# EAGLE design LilyPad-E-Sewing-Kit (EAGLE 6.4)
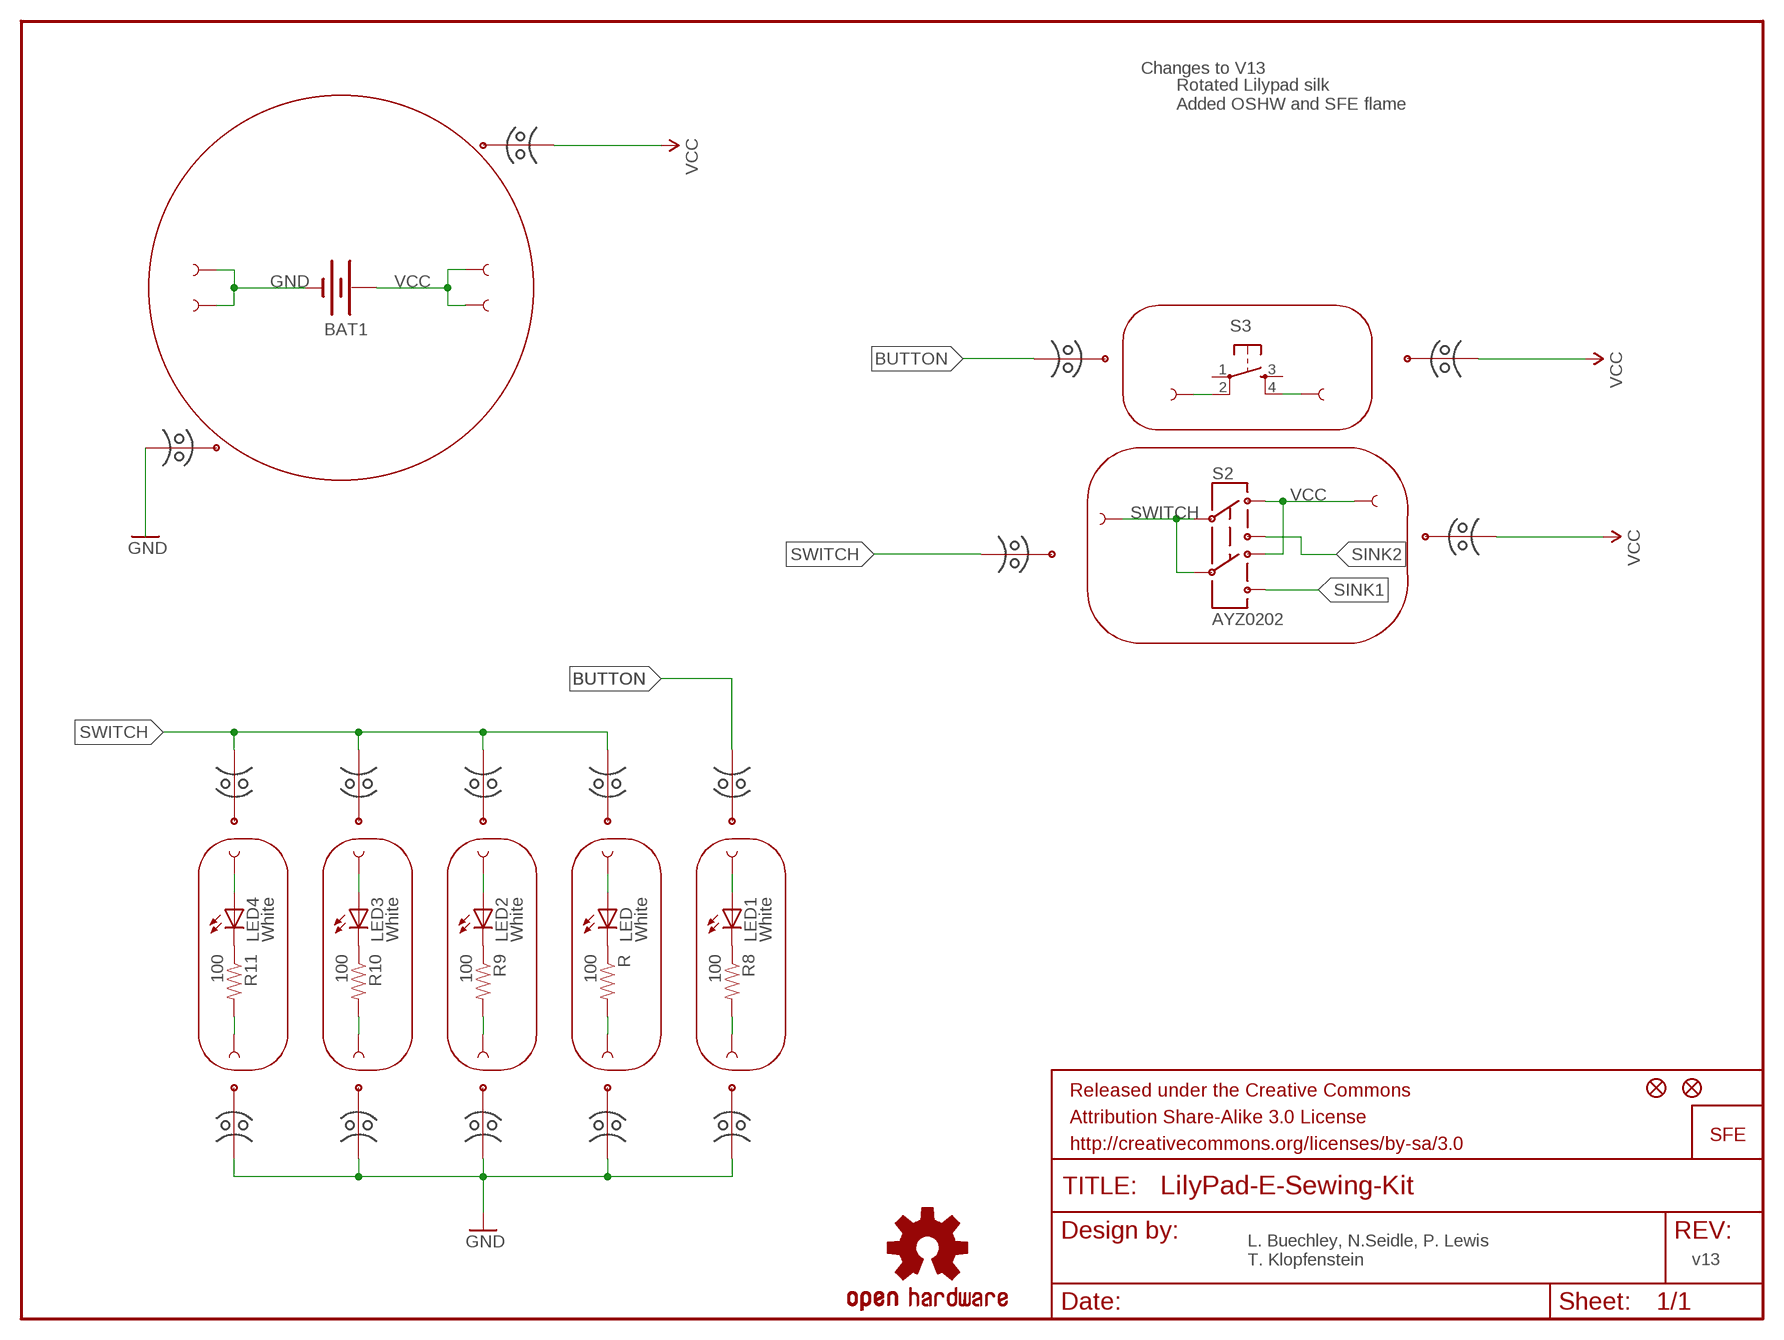
[diagram p0: schematic, sheet 1]

## Parts
BAT1  BATTERYBATTCON_20MM_4LEGS  [BATTCON_20MM_4LEGS]
BUTTON-  SEWTAP8  SEWTAP4  [PETAL-SMALL]
BUTTONS  SEWTAP8  SEWTAP4  [PETAL-SMALL]
JP1  FIDUCIAL1X2  [FIDUCIAL-1X2]
JP2  LOGO-SFESK  [SFE-LOGO-FLAME]
JP4  FIDUCIAL1X2  [FIDUCIAL-1X2]
LED  White  LED1206  [LED-1206]
LED1  White  LED1206  [LED-1206]
LED2  White  LED1206  [LED-1206]
LED3  White  LED1206  [LED-1206]
LED4  White  LED1206  [LED-1206]
LED+  SEWTAP6  [PETAL-SMALL-2SIDE]
LED+1  SEWTAP6  [PETAL-SMALL-2SIDE]
LED+2  SEWTAP6  [PETAL-SMALL-2SIDE]
LED+3  SEWTAP6  [PETAL-SMALL-2SIDE]
LED+4  SEWTAP6  [PETAL-SMALL-2SIDE]
LED-  SEWTAP6  [PETAL-SMALL-2SIDE]
LED-1  SEWTAP6  [PETAL-SMALL-2SIDE]
LED-2  SEWTAP6  [PETAL-SMALL-2SIDE]
LED-3  SEWTAP6  [PETAL-SMALL-2SIDE]
LED-4  SEWTAP6  [PETAL-SMALL-2SIDE]
R  100  RESISTOR0603-RES  [0603-RES]
R8  100  RESISTOR0603-RES  [0603-RES]
R9  100  RESISTOR0603-RES  [0603-RES]
R10  100  RESISTOR0603-RES  [0603-RES]
R11  100  RESISTOR0603-RES  [0603-RES]
S2  AYZ0202  [AYZ0202]
S3  TAC_SWITCHSMD  [TACTILE_SWITCH_SMD]
SLIDEOFF  SEWTAP8  SEWTAP4  [PETAL-SMALL]
SLIDEON  SEWTAP8  SEWTAP4  [PETAL-SMALL]
U$1  SEWTAP6  [PETAL-SMALL-2SIDE]
U$2  SEWTAP6  [PETAL-SMALL-2SIDE]
U$3  SEWTAP6  [PETAL-SMALL-2SIDE]
U$4  SEWTAP6  [PETAL-SMALL-2SIDE]
U$6  MOUSE-BITE-12_HOLES  [MOUST-BITE-1-(2_HOLES)]
U$7  MOUSE-BITE-12_HOLES  [MOUST-BITE-1-(2_HOLES)]
U$8  OSHW-LOGOS  [OSHW-LOGO-S]
U$10  MOUSE-BITE-12_HOLES  [MOUST-BITE-1-(2_HOLES)]
U$11  MOUSE-BITE-12_HOLES  [MOUST-BITE-1-(2_HOLES)]
U$12  MOUSE-BITE-12_HOLES  [MOUST-BITE-1-(2_HOLES)]
U$13  MOUSE-BITE-12_HOLES  [MOUST-BITE-1-(2_HOLES)]
U$14  MOUSE-BITE-12_HOLES  [MOUST-BITE-1-(2_HOLES)]
U$15  MOUSE-BITE-12_HOLES  [MOUST-BITE-1-(2_HOLES)]
U$16  MOUSE-BITE-12_HOLES  [MOUST-BITE-1-(2_HOLES)]
U$17  MOUSE-BITE-12_HOLES  [MOUST-BITE-1-(2_HOLES)]
U$18  MOUSE-BITE-12_HOLES  [MOUST-BITE-1-(2_HOLES)]
U$19  MOUSE-BITE-12_HOLES  [MOUST-BITE-1-(2_HOLES)]
U$40  MOUSE-BITE-12_HOLES  [MOUST-BITE-1-(2_HOLES)]
U$42  MOUSE-BITE-12_HOLES  [MOUST-BITE-1-(2_HOLES)]
U$44  MOUSE-BITE-12_HOLES  [MOUST-BITE-1-(2_HOLES)]
U$46  MOUSE-BITE-12_HOLES  [MOUST-BITE-1-(2_HOLES)]

## Nets
BUTTON: BUTTONS.1 LED1.A LED+1.1 S3.2 U$13.P$1 U$42.P$1
GND [VCC]: BAT1.2(-) LED-1.1 LED-2.1 LED-3.1 LED-4.1 LED-.1 R8.2 R9.2 R10.2 R11.2 R.2 U$1.1 U$3.1 U$7.P$1 U$15.P$1 U$16.P$1 U$17.P$1 U$18.P$1 U$19.P$1
N$18: LED.C R.1
N$21: LED1.C R8.1
N$24: LED2.C R9.1
N$27: LED3.C R10.1
N$30: LED4.C R11.1
SINK1: S2.4
SINK2: S2.1
SWITCH: LED2.A LED3.A LED4.A LED+2.1 LED+3.1 LED+4.1 LED+.1 LED.A S2.2 S2.5 SLIDEOFF.1 U$10.P$1 U$11.P$1 U$12.P$1 U$14.P$1 U$44.P$1
VCC: BAT1.1(+) BUTTON-.1 S2.3 S2.6 S3.4 SLIDEON.1 U$2.1 U$4.1 U$6.P$1 U$40.P$1 U$46.P$1
Unconnected: S3.1 S3.3

## Notes on the sheet
- Changes to V13
- Rotated Lilypad silk
  Added OSHW and SFE flame
- L. Buechley, N.Seidle, P. Lewis
  T. Klopfenstein
- v13

## Library data of the parts
BAT1 = Testing:BATTERY: Battery Holders Various common sizes : AA, AAA, 20mm coin cell and 12mm coin cell.
BUTTON- BUTTONS LED+ LED+1-LED+4 LED- LED-1-LED-4 SLIDEOFF SLIDEON U$1-U$4 = LilyPad-Wearables:SEWTAP
JP1 JP4 = SparkFun:FIDUCIAL: Fiducial Alignment Points Various fiducial points for machine vision alignment.
JP2 = SparkFun-Aesthetics:LOGO-SFE: Spark Fun Electronics PCB Logo This is the standard Spark Fun Electronics PCB logo.
LED LED1-LED4 = SparkFun-3-2-07:LED: LEDs Standard schematic elements and footprints for 5mm, 3mm, 1206, and 0603 sized LEDs. 5mm - Spark Fun Electronics SKU : Comp-SBL
R R8-R11 = SparkFun:RESISTOR: Resistor Basic schematic elements and footprints for 0603, 1206, and PTH resistors.
S2 = SparkFun:AYZ0202: SPDT Slide Switch Simple SMD single-pull double-throw slide switch. Good for less than 350mA power switch, switching UARTs between devices, etc. Spark Fun Electronics SKU : COM-00597
S3 = SparkFun:TAC_SWITCH: Momentary Switch Button commonly used for reset or general input. Spark Fun Electronics SKU : COM-00097
U$6 U$7 U$10-U$19 U$40 U$42 U$44 U$46 = Testing:MOUSE-BITE-1
U$8 = SparkFun-Aesthetics:OSHW-LOGO: Open Source Hardware Logo This logo indicates the piece of hardware it is found on incorporates a OSHW license and/or adheres to the definition of open source hardware found here: http://freedomdefined.org/OSHW

## Net classes
1 VCC: width 0.203 mm

## Board
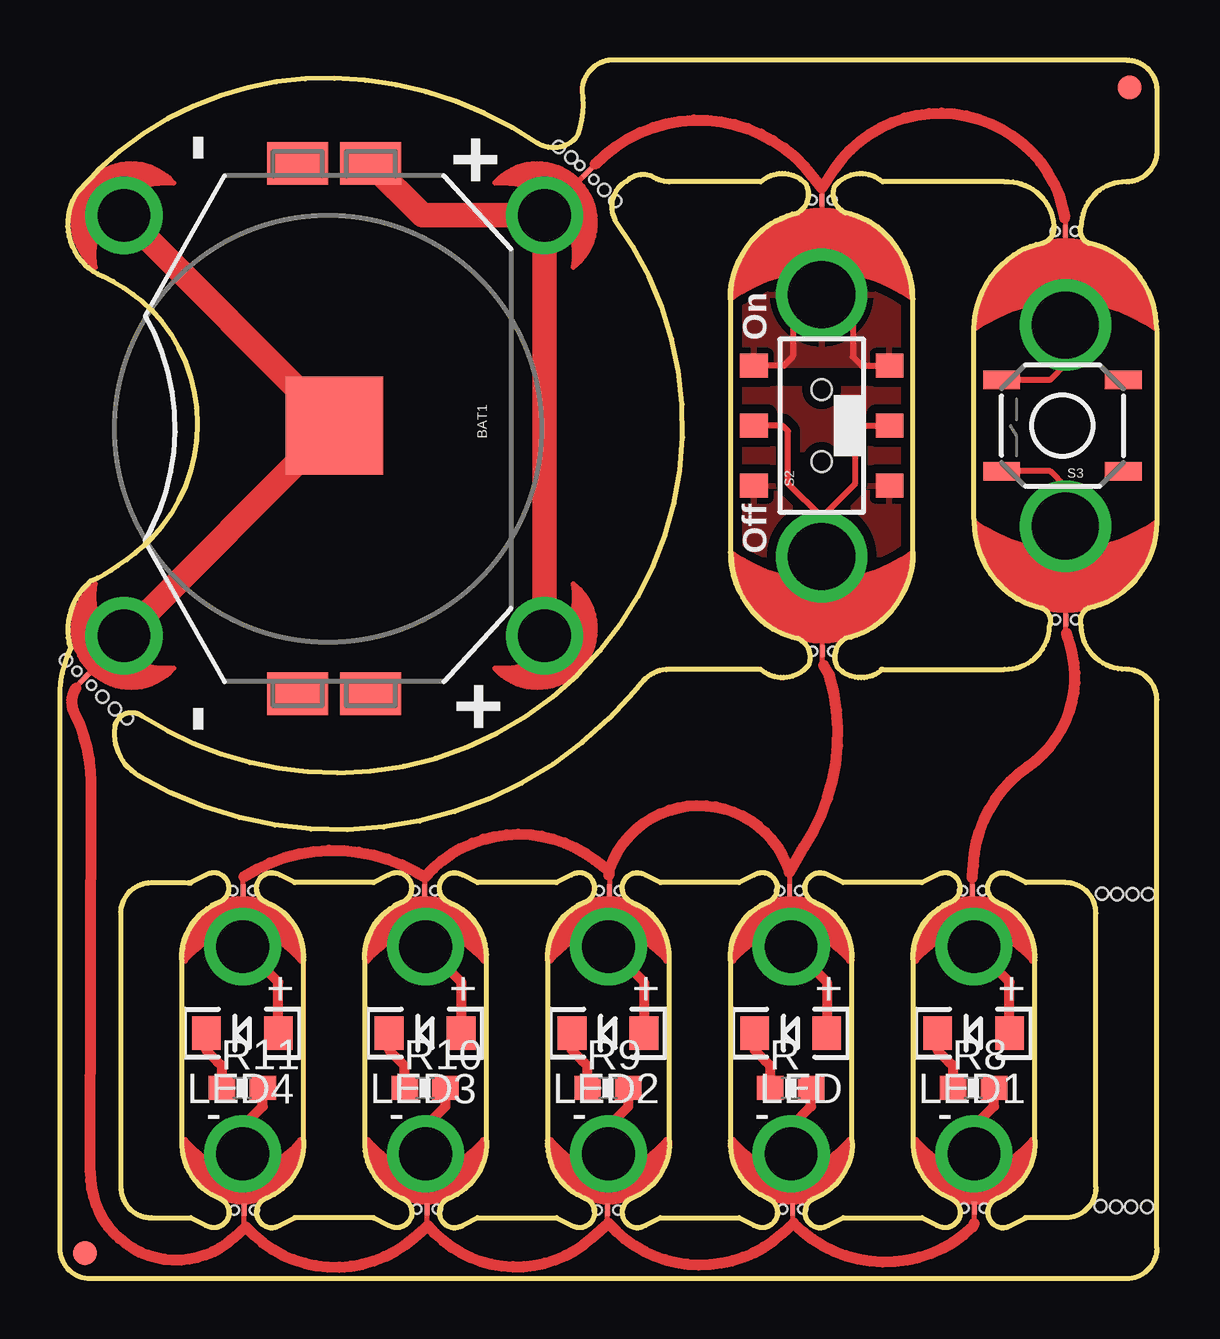
[diagram p1: board, top side]
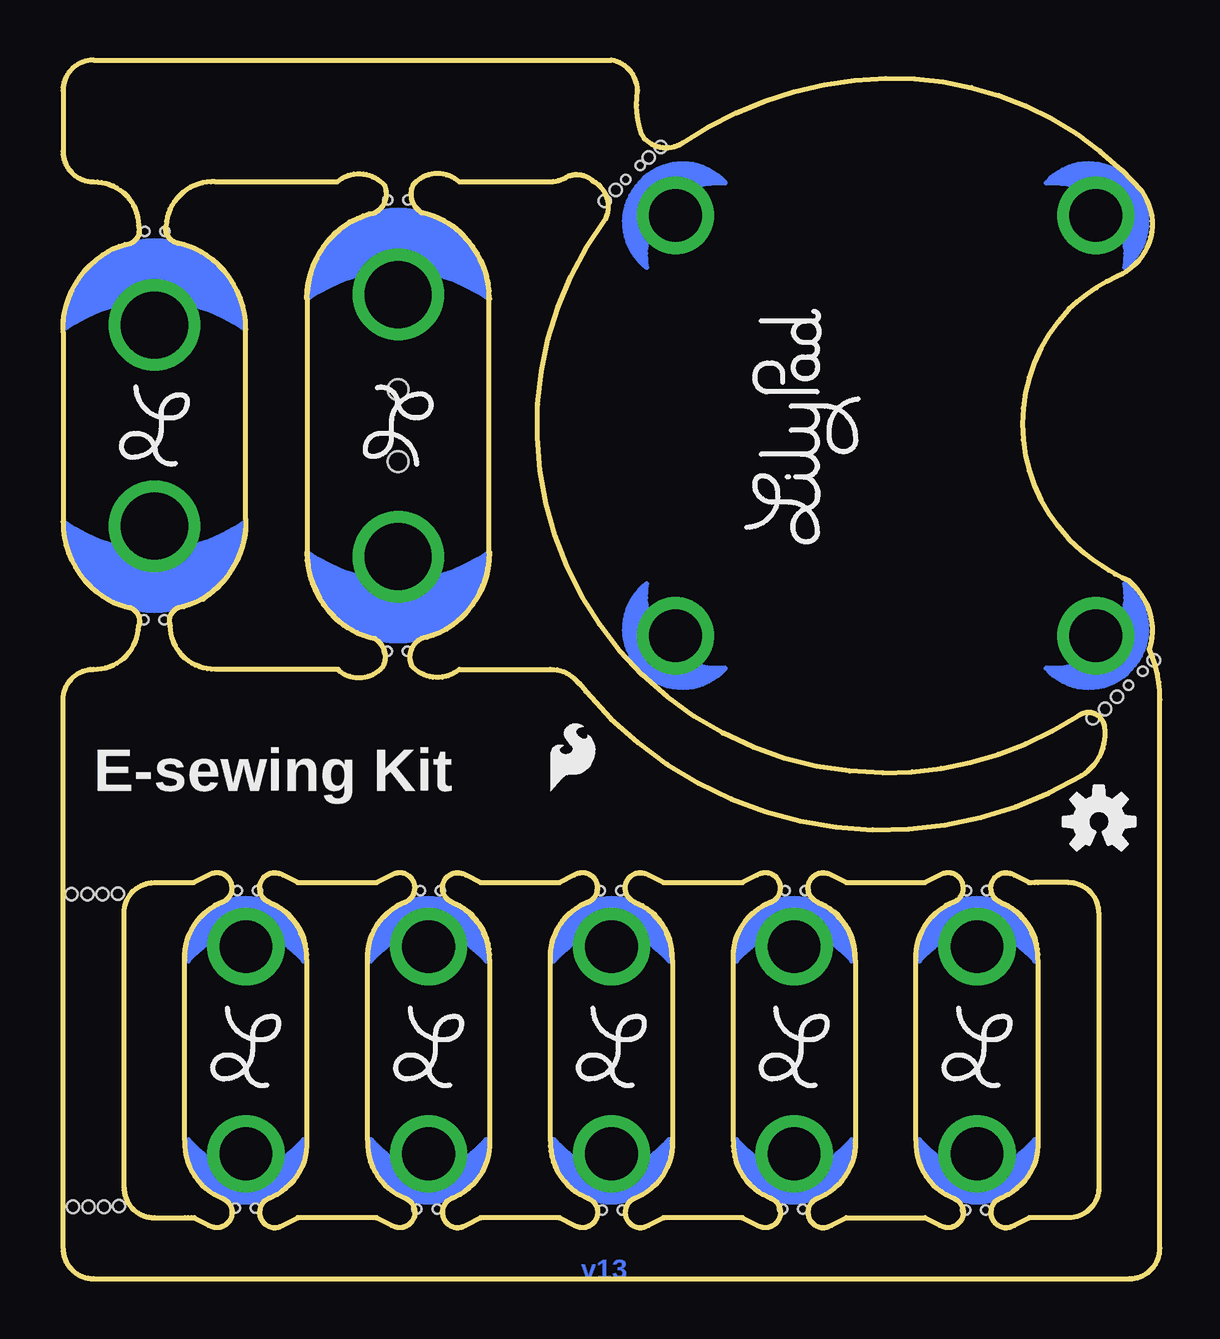
[diagram p2: board, bottom side, seen from below]

Size 45.72 x 50.8 mm. Coordinates in mm from the lower left corner, seen from the top.
Outline: 45.72,39.47 45.72,31.55
Outline: 45.72,31.55 arc-56 44.07,28.45
Outline: 38.1,31.62 arc57 39.88,28.32
Outline: 38.1,31.65 38.1,39.57
Outline: 38.1,39.57 arc-56 39.75,42.67
Outline: 29.72,27.08 arc-57 27.96,30.28 27.96,41.02
Outline: 27.96,41.02 arc-18 28.12,41.96
Outline: 28.12,41.96 arc-25 29.01,43.46
Outline: 29.01,43.46 arc-14 29.64,43.99
Outline: 33.78,44.04 arc-57 35.53,40.84 35.53,30.1
Outline: 35.53,30.1 arc-18 35.38,29.16
Outline: 35.38,29.16 arc-25 34.49,27.66
Outline: 34.49,27.66 arc-14 33.86,27.13 arc14 34.49,27.66
Outline: 40.24,2.54 arc1 40.64,2.54 41.91,2.54 arc90 43.18,3.81 43.18,15.24 arc90 41.91,16.51 40.26,16.51
Outline: 23.12,44.15 arc-126 11.56,21.08 arc-33 3.43,23.44 arc4 3.24,23.56
Outline: 19.94,47.31 arc33 11.43,50.04 arc50 0.76,45.34 arc103 1.78,41.78 arc-20 3.81,40.39 arc-88 3.81,30.86 arc-14 2.41,29.72 arc-13 1.27,29.08
Outline: 34.24,25.4 39.37,25.4 arc90 41.25,27.21
Outline: 21.48,47.52 arc-77 19.9,47.34
Outline: 23.13,44.13 arc-88 23.62,45.75 arc-64 24.66,45.96 arc32 25.4,45.72 29.21,45.72 arc-90 31.1,45.63
Outline: 0.45,26.26 arc26 0,24.13 0,1.27 arc90 1.27,0 44.45,0 arc90 45.72,1.27 45.72,24.13 arc90 44.45,25.4 arc-90 42.57,27.21
Outline: 24.22,24.81 arc-53 25.4,25.4 29.21,25.4 arc90 31.19,25.56
Outline: 24.22,24.83 23.92,24.47 arc-81 3.28,20.96 arc-67 2.3,23 arc-106 3.26,23.54
Outline: 21.49,47.51 21.61,47.72 arc27 21.77,49.52 arc-79 22.86,50.8 44.45,50.8 arc-90 45.72,49.53 45.72,46.99 arc-90 44.45,45.72 arc90 42.57,43.91
Outline: 1.27,29.08 1.09,28.9 arc63 0.45,26.25
Outline: 5.48,16.5 arc1 5.08,16.51 3.81,16.51 arc90 2.54,15.24 2.54,3.81 arc90 3.81,2.54 5.46,2.54
Outline: 8.76,15.62 arc-65 10.16,13.41 10.16,5.77
Outline: 5.08,13.28 arc-64 6.46,15.61
Outline: 10.16,5.77 arc-64 8.91,3.5 arc64 10.16,5.77
Outline: 5.08,13.28 5.08,5.64
Outline: 10.16,13.28 arc64 8.91,15.54
Outline: 9.17,16.82 9.04,16.88 arc90 8.23,16.5 arc90 8.61,15.69 8.93,15.54
Outline: 9.79,16.51 9.18,16.82
Outline: 5.08,13.28 arc-64 6.33,15.54
Outline: 6.07,16.82 6.2,16.88 arc-90 7.01,16.5 arc-90 6.63,15.69 6.31,15.54
Outline: 5.45,16.51 6.07,16.82
Outline: 5.08,5.77 arc64 6.33,3.5
Outline: 6.07,2.23 6.2,2.17 arc90 7.01,2.55 arc90 6.63,3.36 6.31,3.51
Outline: 5.45,2.54 6.07,2.23
Outline: 9.17,2.23 9.04,2.17 arc-90 8.23,2.55 arc-90 8.61,3.36 8.93,3.51
Outline: 9.79,2.54 9.18,2.23
Outline: 16.38,15.62 arc-65 17.78,13.41 17.78,5.77
Outline: 12.7,13.28 arc-64 14.08,15.61
Outline: 17.78,5.77 arc-64 16.54,3.5 arc64 17.78,5.77
Outline: 12.7,13.28 12.7,5.64
Outline: 17.78,13.28 arc64 16.54,15.54
Outline: 16.79,16.82 16.66,16.88 arc90 15.85,16.5 arc90 16.23,15.69 16.55,15.54
Outline: 17.41,16.51 16.79,16.82
Outline: 12.7,13.28 arc-64 13.95,15.54
Outline: 13.69,16.82 13.81,16.88 arc-90 14.63,16.5 arc-90 14.25,15.69 13.93,15.54
Outline: 13.07,16.51 13.69,16.82
Outline: 12.7,5.77 arc64 13.95,3.5
Outline: 13.69,2.23 13.81,2.17 arc90 14.63,2.55 arc90 14.25,3.36 13.93,3.51
Outline: 13.07,2.54 13.69,2.23
Outline: 16.79,2.23 16.66,2.17 arc-90 15.85,2.55 arc-90 16.23,3.36 16.55,3.51
Outline: 17.41,2.54 16.79,2.23
Outline: 24,15.62 arc-65 25.4,13.41 25.4,5.77
Outline: 20.32,13.28 arc-64 21.7,15.61
Outline: 25.4,5.77 arc-64 24.16,3.5 arc64 25.4,5.77
Outline: 20.32,13.28 20.32,5.64
Outline: 25.4,13.28 arc64 24.16,15.54
Outline: 24.41,16.82 24.29,16.88 arc90 23.47,16.5 arc90 23.85,15.69 24.17,15.54
Outline: 25.03,16.51 24.41,16.82
Outline: 20.32,13.28 arc-64 21.57,15.54
Outline: 21.31,16.82 21.43,16.88 arc-90 22.25,16.5 arc-90 21.87,15.69 21.55,15.54
Outline: 20.69,16.51 21.3,16.82
Outline: 20.32,5.77 arc64 21.57,3.5
Outline: 21.31,2.23 21.43,2.17 arc90 22.25,2.55 arc90 21.87,3.36 21.55,3.51
Outline: 20.69,2.54 21.3,2.23
Outline: 24.41,2.23 24.29,2.17 arc-90 23.47,2.55 arc-90 23.85,3.36 24.17,3.51
Outline: 25.03,2.54 24.41,2.23
Outline: 31.62,15.62 arc-65 33.02,13.41 33.02,5.77
Outline: 27.94,13.28 arc-64 29.32,15.61
Outline: 33.02,5.77 arc-64 31.77,3.5 arc64 33.02,5.77
Outline: 27.94,13.28 27.94,5.64
Outline: 33.02,13.28 arc64 31.77,15.54
Outline: 32.03,16.82 31.91,16.88 arc90 31.09,16.5 arc90 31.47,15.69 31.79,15.54
Outline: 32.65,16.51 32.03,16.82
Outline: 27.94,13.28 arc-64 29.18,15.54
Outline: 28.93,16.82 29.05,16.88 arc-90 29.87,16.5 arc-90 29.49,15.69 29.17,15.54
Outline: 28.31,16.51 28.93,16.82
Outline: 27.94,5.77 arc64 29.18,3.5
Outline: 28.93,2.23 29.05,2.17 arc90 29.87,2.55 arc90 29.49,3.36 29.17,3.51
Outline: 28.31,2.54 28.93,2.23
Outline: 32.03,2.23 31.91,2.17 arc-90 31.09,2.55 arc-90 31.47,3.36 31.79,3.51
Outline: 32.65,2.54 32.03,2.23
Outline: 39.24,15.62 arc-65 40.64,13.41 40.64,5.77
Outline: 35.56,13.28 arc-64 36.94,15.61
Outline: 40.64,5.77 arc-64 39.4,3.5 arc64 40.64,5.77
Outline: 35.56,13.28 35.56,5.64
Outline: 40.64,13.28 arc64 39.4,15.54
Outline: 39.65,16.82 39.52,16.88 arc90 38.71,16.5 arc90 39.09,15.69 39.41,15.54
Outline: 40.27,16.51 39.65,16.82
Outline: 35.56,13.28 arc-64 36.8,15.54
Outline: 36.55,16.82 36.67,16.88 arc-90 37.49,16.5 arc-90 37.11,15.69 36.79,15.54
Outline: 35.93,16.51 36.55,16.82
Outline: 35.56,5.77 arc64 36.8,3.5
Outline: 36.55,2.23 36.67,2.17 arc90 37.49,2.55 arc90 37.11,3.36 36.79,3.51
Outline: 35.93,2.54 36.55,2.23
Outline: 39.65,2.23 39.52,2.17 arc-90 38.71,2.55 arc-90 39.09,3.36 39.41,3.51
Outline: 40.27,2.54 39.65,2.23
Outline: 41.43,43.89 arc90 39.37,45.72 34.29,45.72 arc90 32.31,45.56
Outline: 38.1,39.57 arc-56 39.75,42.67
Outline: 45.72,31.55 arc-56 44.07,28.45
Outline: 40.91,43.16 arc90 41.43,43.89
Outline: 39.75,42.67 arc-23 40.94,43.16 arc23 39.75,42.67
Outline: 38.1,39.57 arc-56 39.75,42.67
Outline: 38.1,31.55 arc56 39.75,28.45 arc23 40.94,27.96
Outline: 40.91,27.96 arc-90 41.25,27.21
Outline: 45.72,31.55 arc-56 44.07,28.45
Outline: 42.91,27.96 arc90 42.57,27.21
Outline: 44.07,28.45 arc-23 42.88,27.96
Outline: 45.72,39.57 arc56 44.07,42.67 arc23 42.88,43.16
Outline: 42.91,43.16 arc-90 42.57,43.91
Outline: 27.96,41.02 arc-18 28.12,41.96
Outline: 28.12,41.96 arc-25 29.01,43.46
Outline: 35.53,30.1 arc-18 35.38,29.16
Outline: 35.38,29.16 arc-25 34.49,27.66
Outline: 27.94,30.28 arc56 29.59,27.18 arc23 30.78,26.69
Outline: 30.75,26.69 arc-90 31.19,25.55
Outline: 34.29,25.4 arc-90 32.4,25.49
Outline: 35.56,30.28 arc-56 33.91,27.18 arc-23 32.72,26.69
Outline: 32.75,26.69 arc90 32.4,25.48
Outline: 35.56,40.84 arc56 33.91,43.94 arc23 32.72,44.43
Outline: 32.75,44.43 arc-90 32.31,45.57
Outline: 27.94,40.84 arc-56 29.59,43.94 arc-23 30.78,44.43
Outline: 30.75,44.43 arc90 31.1,45.64
Outline: 13.08,2.54 9.78,2.54
Outline: 17.4,2.54 20.7,2.54
Outline: 25.02,2.54 28.32,2.54
Outline: 32.64,2.54 35.94,2.54
Outline: 35.94,16.51 32.64,16.51
Outline: 28.32,16.51 25.02,16.51
Outline: 20.7,16.51 17.4,16.51
Outline: 13.08,16.51 9.78,16.51
Copper layers (1*16): Top 0.035mm / dielectric 1.5mm / Bottom 0.035mm
Design rules "SparkFun *": minimum track width 6mil, minimum drill 15mil, track to track 8mil, track to pad 8mil, pad to pad 8mil, via to via 8mil, smd to smd 8mil, copper to edge 10mil, drill to drill 8mil, minimum pad ring 12mil, minimum via ring 10mil, stop-mask expansion 4mil, vias tented up to drill 20mil, thermal gap 10mil
Holes 0.51 mm at 1.78,24.26 2.29,23.75 2.79,23.37 0.25,25.78 21.31,46.74 20.8,47.18 22.69,45.38 23.14,44.92 43.38,3.02 44.02,3 44.65,3 45.31,3 43.43,16.05 44.07,16.03 44.7,16.03 45.36,16.03

### Footprints (pad centres in the part's own frame; a part is rotated, then mirrored left to right if it is on the bottom)
BATTCON_20MM_4LEGS = smd 1.778 x 2.54: 1 -10.922,1.524; 3 11.176,1.524; P$1 -10.922,-1.524; P$2 11.176,-1.524 | smd 4.064 x 4.064: 2 0,0
PETAL-MEDIUM-2SIDE = drill 2.794: 1 0,-0.254
FIDUCIAL-1X2 = smd 1 x 1: 1 0,0
LED-1206 = smd 1.2 x 1.4: A -1.5,0; C 1.5,0
PETAL-SMALL-2SIDE = drill 2.2: 1 0,0
0603-RES = smd 1.1 x 1: 1 -0.85,0; 2 0.85,0
AYZ0202 = smd 1 x 1.15: 1 -2.5,2.825; 2 0,2.825; 3 2.5,2.825; 4 -2.5,-2.825; 5 0,-2.825; 6 2.5,-2.825 | hole 0.85: 1.5,0; -1.5,0
TACTILE_SWITCH_SMD = smd 1.524 x 0.762: 1 -2.54,1.905; 2 2.54,1.905; 3 -2.54,-1.905; 4 2.54,-1.905
MOUST-BITE-1-(2_HOLES) = smd 0.203 x 0.508 bottom: P$1 -0.013,0 | hole 0.381: -0.432,0; 0.406,0

### Placement (x,y rotation side)
BAT1  11.43,35.56 270 top
BUTTON-  SEWTAP8  [PETAL-MEDIUM-2SIDE]  41.91,39.5 180 top
BUTTONS  SEWTAP8  [PETAL-MEDIUM-2SIDE]  41.91,31.62 0 top
JP1  44.58,49.66 0 top
JP2  25.4,20.32 0 bottom
JP4  1.04,1.07 0 top
LED  30.46,10.24 180 top
LED1  38.08,10.24 180 top
LED2  22.84,10.24 180 top
LED3  15.22,10.24 180 top
LED4  7.6,10.24 180 top
LED+  30.48,13.84 180 top
LED+1  38.1,13.84 180 top
LED+2  22.86,13.84 180 top
LED+3  15.24,13.84 180 top
LED+4  7.62,13.84 180 top
LED-  30.48,5.21 0 top
LED-1  38.1,5.21 0 top
LED-2  22.86,5.21 0 top
LED-3  15.24,5.21 0 top
LED-4  7.62,5.21 0 top
LOGO1  LOGO-LPL  [LOGO-L]  31.75,35.56 180 bottom
LOGO2  LOGO-LPL  [LOGO-L]  41.91,35.56 0 bottom
LOGO3  LOGO-LPL  [LOGO-L]  22.86,9.65 0 bottom
LOGO4  LOGO-LPL  [LOGO-L]  30.48,9.65 0 bottom
LOGO5  LOGO-LPL  [LOGO-L]  15.24,9.65 0 bottom
LOGO6  LOGO-LPL  [LOGO-L]  7.62,9.65 0 bottom
LOGO7  LOGO-LPL  [LOGO-L]  38.1,9.65 0 bottom
R  30.46,7.95 0 top
R8  38.08,7.95 0 top
R9  22.84,7.95 0 top
R10  15.22,7.95 0 top
R11  7.6,7.95 0 top
S2  31.75,35.56 90 top
S3  41.78,35.56 180 top
SLIDEOFF  SEWTAP8  [PETAL-MEDIUM-2SIDE]  31.75,30.35 0 top
SLIDEON  SEWTAP8  [PETAL-MEDIUM-2SIDE]  31.75,40.77 180 top
U$1  2.67,44.32 227 top
U$2  20.19,44.32 133 top
U$3  2.67,26.8 313 top
U$4  20.19,26.8 47 top
U$5  LOGO-LPLP  [LOGO-LILYPAD]  15.24,35.56 90 bottom
U$6  21.97,46.1 225 bottom
U$7  1.02,25.02 225 bottom
U$8  2.54,19.05 0 bottom
U$9  [CREATIVE_COMMONS]  3.81,-11.43 0 top  (outside the outline)
U$10  7.62,16.18 0 bottom
U$11  15.21,16.18 180 bottom
U$12  22.91,16.18 180 bottom
U$13  38.05,16.18 180 bottom
U$14  30.43,16.18 180 bottom
U$15  7.67,2.87 0 bottom
U$16  15.29,2.9 0 bottom
U$17  22.81,2.87 0 bottom
U$18  38.1,2.95 0 bottom
U$19  30.53,2.9 0 bottom
U$40  41.91,43.66 180 bottom
U$42  41.91,27.46 0 bottom
U$44  31.78,26.16 0 bottom
U$46  31.78,44.96 180 bottom

### Tracks (layer width: path | path; a pad name or v marks a point on that pad's centre or on a via)
BUTTON
  Top 0.203: BUTTONS.1 41.92,31.37 U$42.P$1 41.92,26.8 42.02,26.7 | 38.02,16.73 38.04,16.71 U$13.P$1 38.04,14.03 38.1,13.97
  Top 0.254: S3.2 41.27,33.66 41.91,33.02 BUTTONS.1
  Top 0.406: 38.1,13.97 LED+1.1 39.58,12.36 LED1.A
  Top 0.457: 41.96,26.9 42.02,26.7 42.09,26.47 arc-73 40.36,21.36 arc53 38.08,17.22 38.02,16.76 38.02,16.73
GND
  Top 0.203: 38.11,2.3 U$18.P$1 38.11,5.21 LED-1.1 | 30.58,2.31 30.54,2.31 U$19.P$1 30.54,5.21 LED-.1 | 22.86,2.31 22.82,2.31 U$17.P$1 22.82,5.21 LED-2.1 | 15.34,2.21 15.3,2.21 U$16.P$1 15.3,5.21 LED-3.1 | 7.75,2.16 7.68,2.16 U$15.P$1 7.68,5.21 LED-4.1 | 0.66,24.61 0.71,24.73 U$7.P$1 2.67,26.69 U$3.1
  Top 0.406: LED-1.1 38.1,6.35 38.93,7.18 R8.2 | LED-.1 30.48,6.35 31.31,7.18 R.2 | LED-2.1 22.86,6.35 23.69,7.18 R9.2 | LED-3.1 15.24,6.35 16.07,7.18 R10.2 | LED-4.1 7.62,6.35 8.45,7.18 R11.2
  Top 0.457: 38.11,2.3 38.05,2.16 arc-89 30.58,2.31 30.1,1.88 arc-90 22.86,2.31 22.17,1.7 arc-92 15.34,2.21 14.76,1.7 arc-89 7.75,2.16 7.24,1.7 arc-133 1.27,4.45 1.29,20.7 arc27 0.64,23.52 arc-61 0.66,24.61
  Top 1.016: U$3.1 BAT1.2 U$1.1
  pour Top (isolate 0.381): 35.56,37.08 27.94,37.08 27.94,34.04 35.56,34.04
N$18
  Top 0.254: 29.4,9.08 29.46,9.02
  Top 0.406: LED.C 28.96,9.52 29.4,9.08 29.61,8.87 R.1
N$21
  Top 0.254: 37.02,9.08 37.08,9.02
  Top 0.406: LED1.C 36.58,9.52 37.02,9.08 37.23,8.87 R8.1
N$24
  Top 0.254: 21.78,9.08 21.84,9.02
  Top 0.406: LED2.C 21.34,9.52 21.78,9.08 21.99,8.87 R9.1
N$27
  Top 0.254: 14.16,9.08 14.22,9.02
  Top 0.406: LED3.C 13.72,9.52 14.16,9.08 14.37,8.87 R10.1
N$30
  Top 0.254: 6.54,9.08 6.6,9.02
  Top 0.406: LED4.C 6.1,9.52 6.54,9.08 6.75,8.87 R11.1
SINK1
  pour Top (isolate 0.381): 35.56,33.02 31.75,33.02 31.75,30.48 arc-223 32.26,29.59 32.64,29.59 33.78,29.92 34.8,30.4 35.56,30.99
SINK2
  pour Top (isolate 0.381): 30.48,33.02 27.94,33.02 27.94,30.86 29.08,30.23 30.35,29.72 30.99,29.59 31.5,31.62
SWITCH
  Top 0.203: 31.83,25.57 31.79,25.6 U$44.P$1 31.79,30.1 SLIDEOFF.1 | 30.4,16.94 30.42,16.94 U$14.P$1 30.42,14.03 arc90 30.48,13.97 | 22.89,16.82 arc-90 22.9,16.8 U$12.P$1 22.9,13.97 22.86,13.97 | 15.21,16.74 15.2,16.73 U$11.P$1 15.2,14.01 15.24,13.97 | 7.67,16.76 7.63,16.73 U$10.P$1 7.63,13.98 7.62,13.97 | 22.86,17.02 22.89,17.04
  Top 0.254: S2.2 30.12,35.56 30.35,35.33 30.35,33.15 31.75,31.75 | S2.5 33.28,35.56 33.15,35.43 33.15,33.15 31.75,31.75 | SLIDEOFF.1 31.75,31.75
  Top 0.406: 7.62,13.97 LED+4.1 9.1,12.36 LED4.A | 15.24,13.97 LED+3.1 16.72,12.36 LED3.A | 22.86,13.97 LED+2.1 24.34,12.36 LED2.A | 30.48,13.97 LED+.1 31.96,12.36 LED.A
  Top 0.457: 31.83,25.57 32.08,25.15 arc-49 31.04,18.03 30.4,16.94 arc137 23.09,17.5 22.89,17.04 22.89,16.82 | 22.86,17.02 22.3,17.45 arc87 15.21,16.74 14.81,16.97 arc62 7.67,16.76
VCC
  Top 0.203: 22.32,46.46 U$6.P$1 21.96,46.09 U$2.1 | 31.75,45.47 31.76,45.45 U$46.P$1 31.76,41.03 SLIDEON.1 | 41.88,44.22 41.9,44.21 U$40.P$1 41.9,39.76 BUTTON-.1
  Top 0.254: S2.3 30.18,38.06 30.55,38.43 30.55,39.84 30.57,39.84 SLIDEON.1 33.05,39.72 33.05,38.43 33.42,38.06 S2.6 | S3.4 41.27,37.47 41.91,38.1 BUTTON-.1 | U$2.1 20.21,44.32
  Top 0.457: 41.88,44.22 41.63,45.19 arc125 32.28,46.25 31.75,45.47 31.04,46.35 arc94 22.32,46.46
  Top 1.016: U$4.1 U$2.1 15.11,44.32 BAT1.1
  pour Top (isolate 0.381): 35.56,38.1 35.56,40.26 34.42,40.89 33.27,41.27 32.38,41.53 30.86,41.53 29.72,41.15 28.57,40.51 27.94,40.13 27.94,38.1

### Text on the board
Bottom: v13
tPlace: - | + | On | Off | + | - | + | + | + | + | + | - | - | - | - | -
bPlace: E-sewing Kit
tValues: L. Buechley, N. Seidle, P. Lewis, T. Klopfenstein